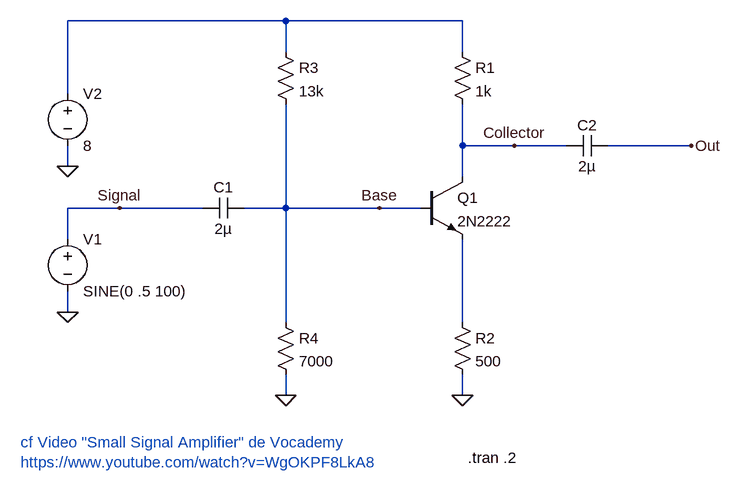
[diagram p0: schematic SmallSignalAmplifier1.asc]
SmallSignalAmplifier1.asc, the LTspice schematic file:
Version 4
SHEET 1 1112 680
WIRE 352 -176 16 -176
WIRE 624 -176 352 -176
WIRE 352 -128 352 -176
WIRE 624 -128 624 -176
WIRE 16 -64 16 -176
WIRE 624 16 624 -48
WIRE 704 16 624 16
WIRE 784 16 704 16
WIRE 976 16 848 16
WIRE 16 48 16 16
WIRE 624 64 624 16
WIRE 96 112 16 112
WIRE 224 112 96 112
WIRE 352 112 352 -48
WIRE 352 112 288 112
WIRE 496 112 352 112
WIRE 560 112 496 112
WIRE 16 160 16 112
WIRE 16 272 16 240
WIRE 352 288 352 112
WIRE 624 288 624 160
WIRE 352 400 352 368
WIRE 624 400 624 368
FLAG 16 272 0
FLAG 16 48 0
FLAG 352 400 0
FLAG 624 400 0
FLAG 96 112 Signal
FLAG 976 16 Out
FLAG 496 112 Base
FLAG 704 16 Collector
SYMBOL voltage 16 144 R0
WINDOW 123 0 0 Left 0
WINDOW 39 0 0 Left 0
SYMATTR InstName V1
SYMATTR Value SINE(0 .5 100)
SYMBOL voltage 16 -80 R0
WINDOW 123 0 0 Left 0
WINDOW 39 0 0 Left 0
SYMATTR InstName V2
SYMATTR Value 8
SYMBOL npn 560 64 R0
SYMATTR InstName Q1
SYMATTR Value 2N2222
SYMBOL res 608 -144 R0
SYMATTR InstName R1
SYMATTR Value 1k
SYMBOL res 608 272 R0
SYMATTR InstName R2
SYMATTR Value 500
SYMBOL res 336 -144 R0
SYMATTR InstName R3
SYMATTR Value 13k
SYMBOL res 336 272 R0
SYMATTR InstName R4
SYMATTR Value 7000
SYMBOL cap 288 96 R90
WINDOW 0 0 32 VBottom 2
WINDOW 3 32 32 VTop 2
SYMATTR InstName C1
SYMATTR Value 2µ
SYMBOL cap 848 0 R90
WINDOW 0 0 32 VBottom 2
WINDOW 3 32 32 VTop 2
SYMATTR InstName C2
SYMATTR Value 2µ
TEXT -56 472 Left 2 ;cf Video "Small Signal Amplifier" de Vocademy\nhttps://www.youtube.com/watch?v=WgOKPF8LkA8
TEXT 632 496 Left 2 !.tran .2

The netlist it stands for:
* SmallSignalAmplifier1.asc
V1 Signal 0 SINE(0 .5 100)
V2 N001 0 8
Q1 Collector Base N002 0 2N2222
R1 N001 Collector 1k
R2 N002 0 500
R3 N001 Base 13k
R4 Base 0 7000
C1 Base Signal 2µ
C2 Out Collector 2µ
.model NPN NPN
.model PNP PNP
.lib standard.bjt
* cf Video "Small Signal Amplifier" de Vocademy
* https://www.youtube.com/watch?v=WgOKPF8LkA8
.tran .2
.backanno
.end